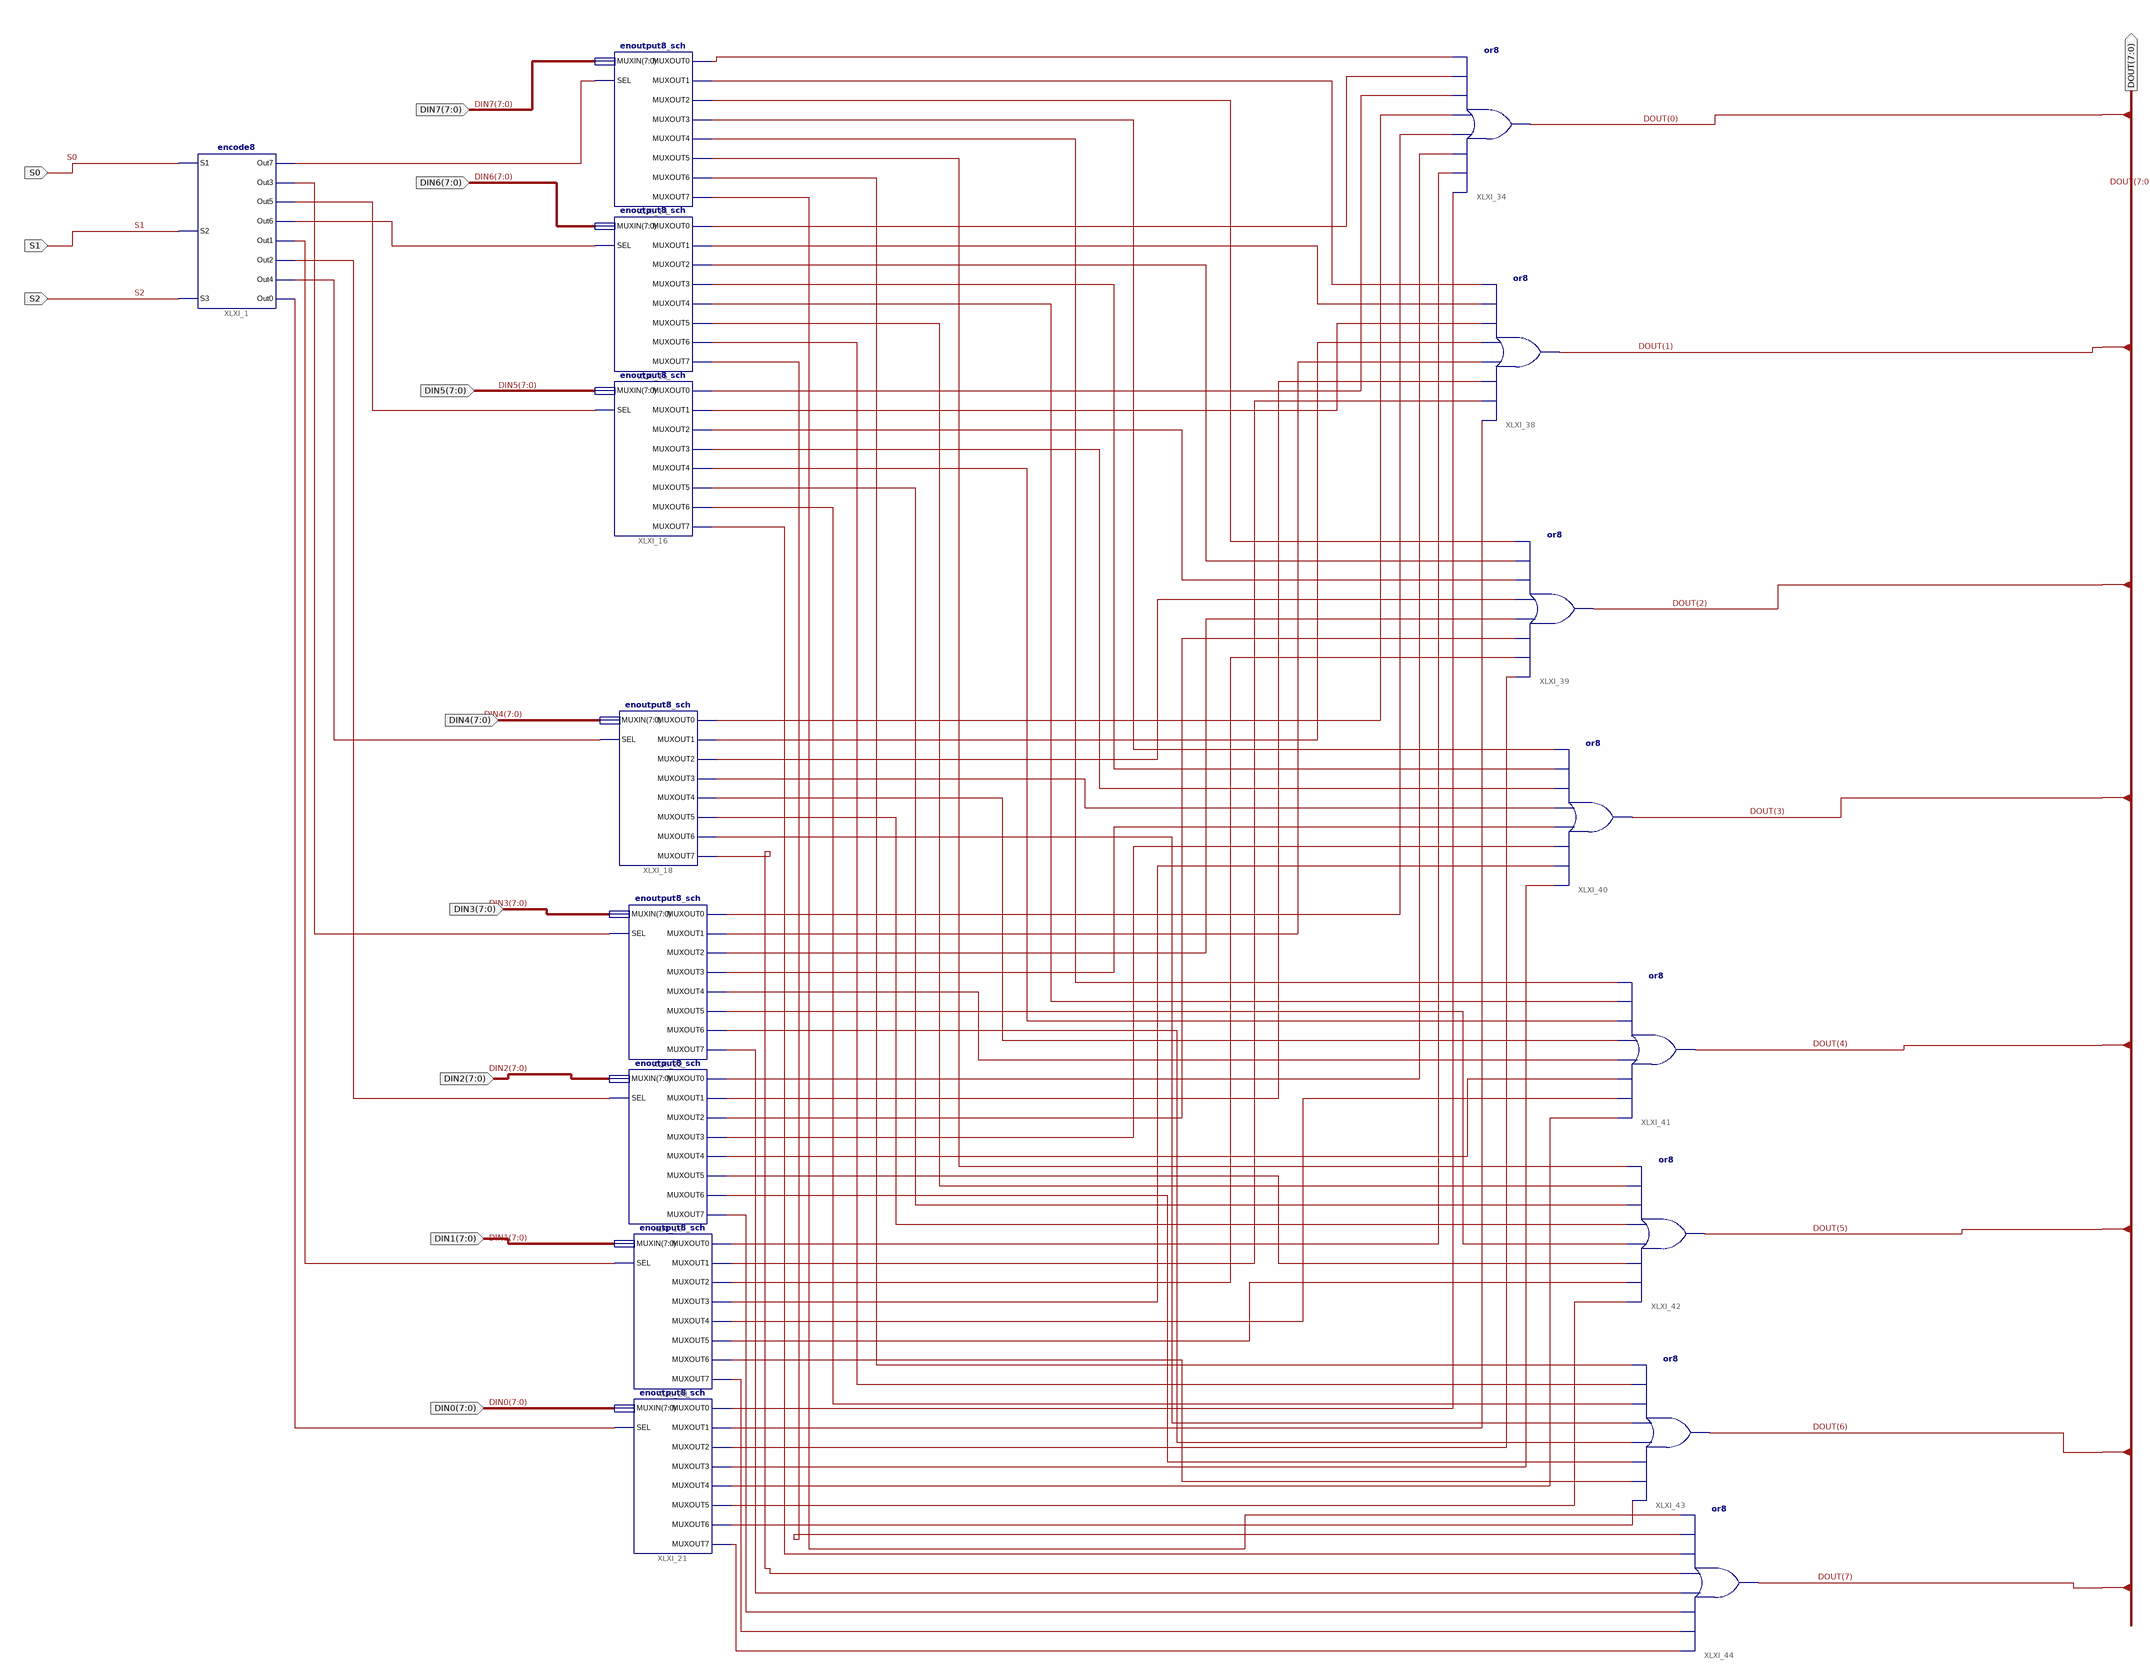
[diagram p0: schematic sheet 1]
// Xilinx ISE schematic bus8_mux.sch (spartan2e) as structural Verilog: 17 symbols, 12 ports
module bus8_mux (
  input  S0,
  input  S1,
  input  S2,
  input  [7:0] DIN6,
  input  [7:0] DIN5,
  input  [7:0] DIN7,
  input  [7:0] DIN3,
  input  [7:0] DIN0,
  input  [7:0] DIN1,
  input  [7:0] DIN2,
  input  [7:0] DIN4,
  output [7:0] DOUT
);

  wire XLXN_9, XLXN_10, XLXN_59, XLXN_60, XLXN_62, XLXN_63, XLXN_64, XLXN_65, XLXN_66, XLXN_67, XLXN_68,
       XLXN_69, XLXN_75, XLXN_76, XLXN_77, XLXN_78, XLXN_90, XLXN_91, XLXN_92, XLXN_93, XLXN_94, XLXN_95,
       XLXN_96, XLXN_97, XLXN_98, XLXN_99, XLXN_100, XLXN_101, XLXN_102, XLXN_103, XLXN_104, XLXN_105,
       XLXN_106, XLXN_107, XLXN_108, XLXN_109, XLXN_110, XLXN_111, XLXN_112, XLXN_113, XLXN_114, XLXN_116,
       XLXN_118, XLXN_119, XLXN_120, XLXN_121, XLXN_122, XLXN_123, XLXN_124, XLXN_125, XLXN_126, XLXN_127,
       XLXN_128, XLXN_129, XLXN_130, XLXN_131, XLXN_133, XLXN_134, XLXN_135, XLXN_136, XLXN_137, XLXN_138,
       XLXN_139, XLXN_140, XLXN_143, XLXN_151, XLXN_154, XLXN_156, XLXN_157, XLXN_158, XLXN_160, XLXN_161;

  encode8 XLXI_1 (
    .S1(S0), .S2(S1), .S3(S2), .Out7(XLXN_9), .Out3(XLXN_10), .Out5(XLXN_60), .Out6(XLXN_59), .Out1(XLXN_63),
    .Out2(XLXN_64), .Out4(XLXN_62), .Out0(XLXN_65));
  enoutput8_sch XLXI_14 (
    .MUXIN(DIN7), .MUXOUT0(XLXN_66), .MUXOUT1(XLXN_90), .MUXOUT2(XLXN_98), .MUXOUT3(XLXN_106),
    .MUXOUT4(XLXN_114), .MUXOUT5(XLXN_124), .MUXOUT6(XLXN_133), .MUXOUT7(XLXN_143), .SEL(XLXN_9));
  enoutput8_sch XLXI_15 (
    .MUXIN(DIN6), .MUXOUT0(XLXN_67), .MUXOUT1(XLXN_91), .MUXOUT2(XLXN_99), .MUXOUT3(XLXN_107),
    .MUXOUT4(XLXN_116), .MUXOUT5(XLXN_125), .MUXOUT6(XLXN_134), .MUXOUT7(XLXN_151), .SEL(XLXN_59));
  enoutput8_sch XLXI_16 (
    .MUXIN(DIN5), .MUXOUT0(XLXN_68), .MUXOUT1(XLXN_92), .MUXOUT2(XLXN_100), .MUXOUT3(XLXN_108),
    .MUXOUT4(XLXN_118), .MUXOUT5(XLXN_126), .MUXOUT6(XLXN_135), .MUXOUT7(XLXN_154), .SEL(XLXN_60));
  enoutput8_sch XLXI_22 (
    .MUXIN(DIN3), .MUXOUT0(XLXN_75), .MUXOUT1(XLXN_94), .MUXOUT2(XLXN_102), .MUXOUT3(XLXN_110),
    .MUXOUT4(XLXN_120), .MUXOUT5(XLXN_128), .MUXOUT6(XLXN_137), .MUXOUT7(XLXN_161), .SEL(XLXN_10));
  enoutput8_sch XLXI_21 (
    .MUXIN(DIN0), .MUXOUT0(XLXN_78), .MUXOUT1(XLXN_97), .MUXOUT2(XLXN_105), .MUXOUT3(XLXN_113),
    .MUXOUT4(XLXN_123), .MUXOUT5(XLXN_131), .MUXOUT6(XLXN_140), .MUXOUT7(XLXN_157), .SEL(XLXN_65));
  enoutput8_sch XLXI_20 (
    .MUXIN(DIN1), .MUXOUT0(XLXN_77), .MUXOUT1(XLXN_96), .MUXOUT2(XLXN_104), .MUXOUT3(XLXN_112),
    .MUXOUT4(XLXN_122), .MUXOUT5(XLXN_130), .MUXOUT6(XLXN_139), .MUXOUT7(XLXN_158), .SEL(XLXN_63));
  enoutput8_sch XLXI_19 (
    .MUXIN(DIN2), .MUXOUT0(XLXN_76), .MUXOUT1(XLXN_95), .MUXOUT2(XLXN_103), .MUXOUT3(XLXN_111),
    .MUXOUT4(XLXN_121), .MUXOUT5(XLXN_129), .MUXOUT6(XLXN_138), .MUXOUT7(XLXN_160), .SEL(XLXN_64));
  enoutput8_sch XLXI_18 (
    .MUXIN(DIN4), .MUXOUT0(XLXN_69), .MUXOUT1(XLXN_93), .MUXOUT2(XLXN_101), .MUXOUT3(XLXN_109),
    .MUXOUT4(XLXN_119), .MUXOUT5(XLXN_127), .MUXOUT6(XLXN_136), .MUXOUT7(XLXN_156), .SEL(XLXN_62));
  or XLXI_34 (DOUT[0], XLXN_78, XLXN_77, XLXN_76, XLXN_75, XLXN_69, XLXN_68, XLXN_67, XLXN_66);
  or XLXI_38 (DOUT[1], XLXN_97, XLXN_96, XLXN_95, XLXN_94, XLXN_93, XLXN_92, XLXN_91, XLXN_90);
  or XLXI_39 (DOUT[2], XLXN_105, XLXN_104, XLXN_103, XLXN_102, XLXN_101, XLXN_100, XLXN_99, XLXN_98);
  or XLXI_40 (DOUT[3], XLXN_113, XLXN_112, XLXN_111, XLXN_110, XLXN_109, XLXN_108, XLXN_107, XLXN_106);
  or XLXI_41 (DOUT[4], XLXN_123, XLXN_122, XLXN_121, XLXN_120, XLXN_119, XLXN_118, XLXN_116, XLXN_114);
  or XLXI_42 (DOUT[5], XLXN_131, XLXN_130, XLXN_129, XLXN_128, XLXN_127, XLXN_126, XLXN_125, XLXN_124);
  or XLXI_43 (DOUT[6], XLXN_140, XLXN_139, XLXN_138, XLXN_137, XLXN_136, XLXN_135, XLXN_134, XLXN_133);
  or XLXI_44 (DOUT[7], XLXN_157, XLXN_158, XLXN_160, XLXN_161, XLXN_156, XLXN_154, XLXN_151, XLXN_143);
endmodule
